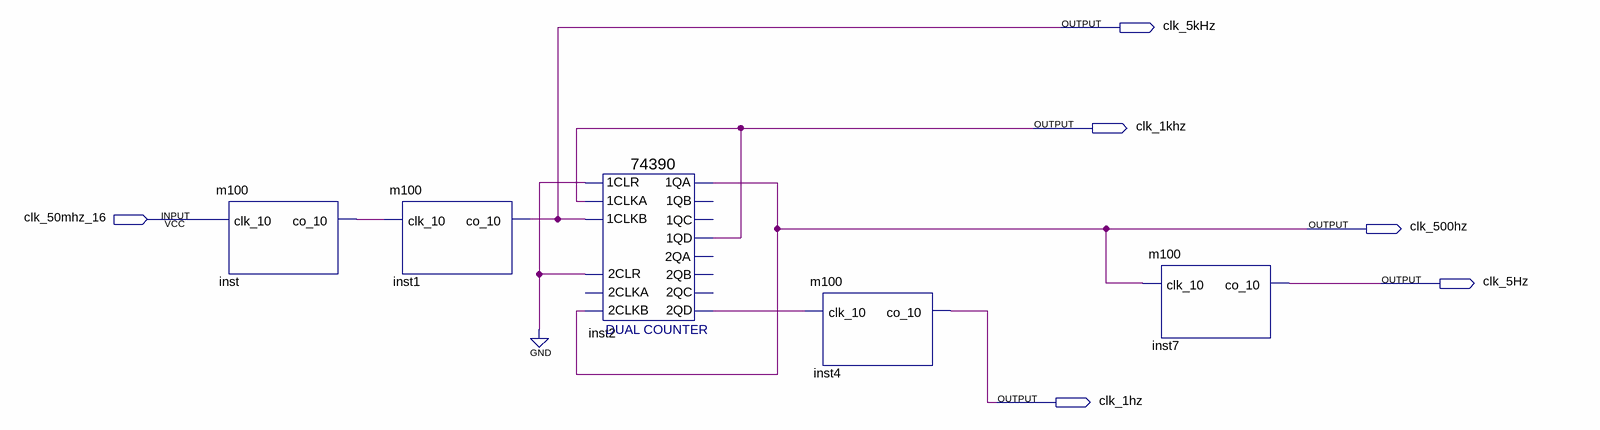
[diagram p0: schematic sheet]
// Quartus schematic fre_div.bdf as structural Verilog: 5 symbols, 6 pins
module fre_div (
  input  clk_50mhz_16,
  output clk_5kHz,
  output clk_1khz,
  output clk_500hz,
  output clk_5Hz,
  output clk_1hz
);

  wire inst2_2qd, inst_co_10;

  m100 inst (.clk_10(clk_50mhz_16), .co_10(inst_co_10));
  m100 inst1 (.clk_10(inst_co_10), .co_10(clk_5kHz));
  \74390  inst2 (
    .\2CLR (1'b0), .\2CLKB (clk_500hz), .\1CLR (1'b0), .\1CLKA (clk_1khz), .\1CLKB (clk_5kHz),
    .\1QA (clk_500hz), .\1QD (clk_1khz), .\2QD (inst2_2qd));  // open: 2CLKA, 1QB, 1QC, 2QA, 2QB, 2QC
  m100 inst4 (.clk_10(inst2_2qd), .co_10(clk_1hz));
  m100 inst7 (.clk_10(clk_500hz), .co_10(clk_5Hz));
endmodule
